# EAGLE design mainboard (EAGLE 9.2.1)
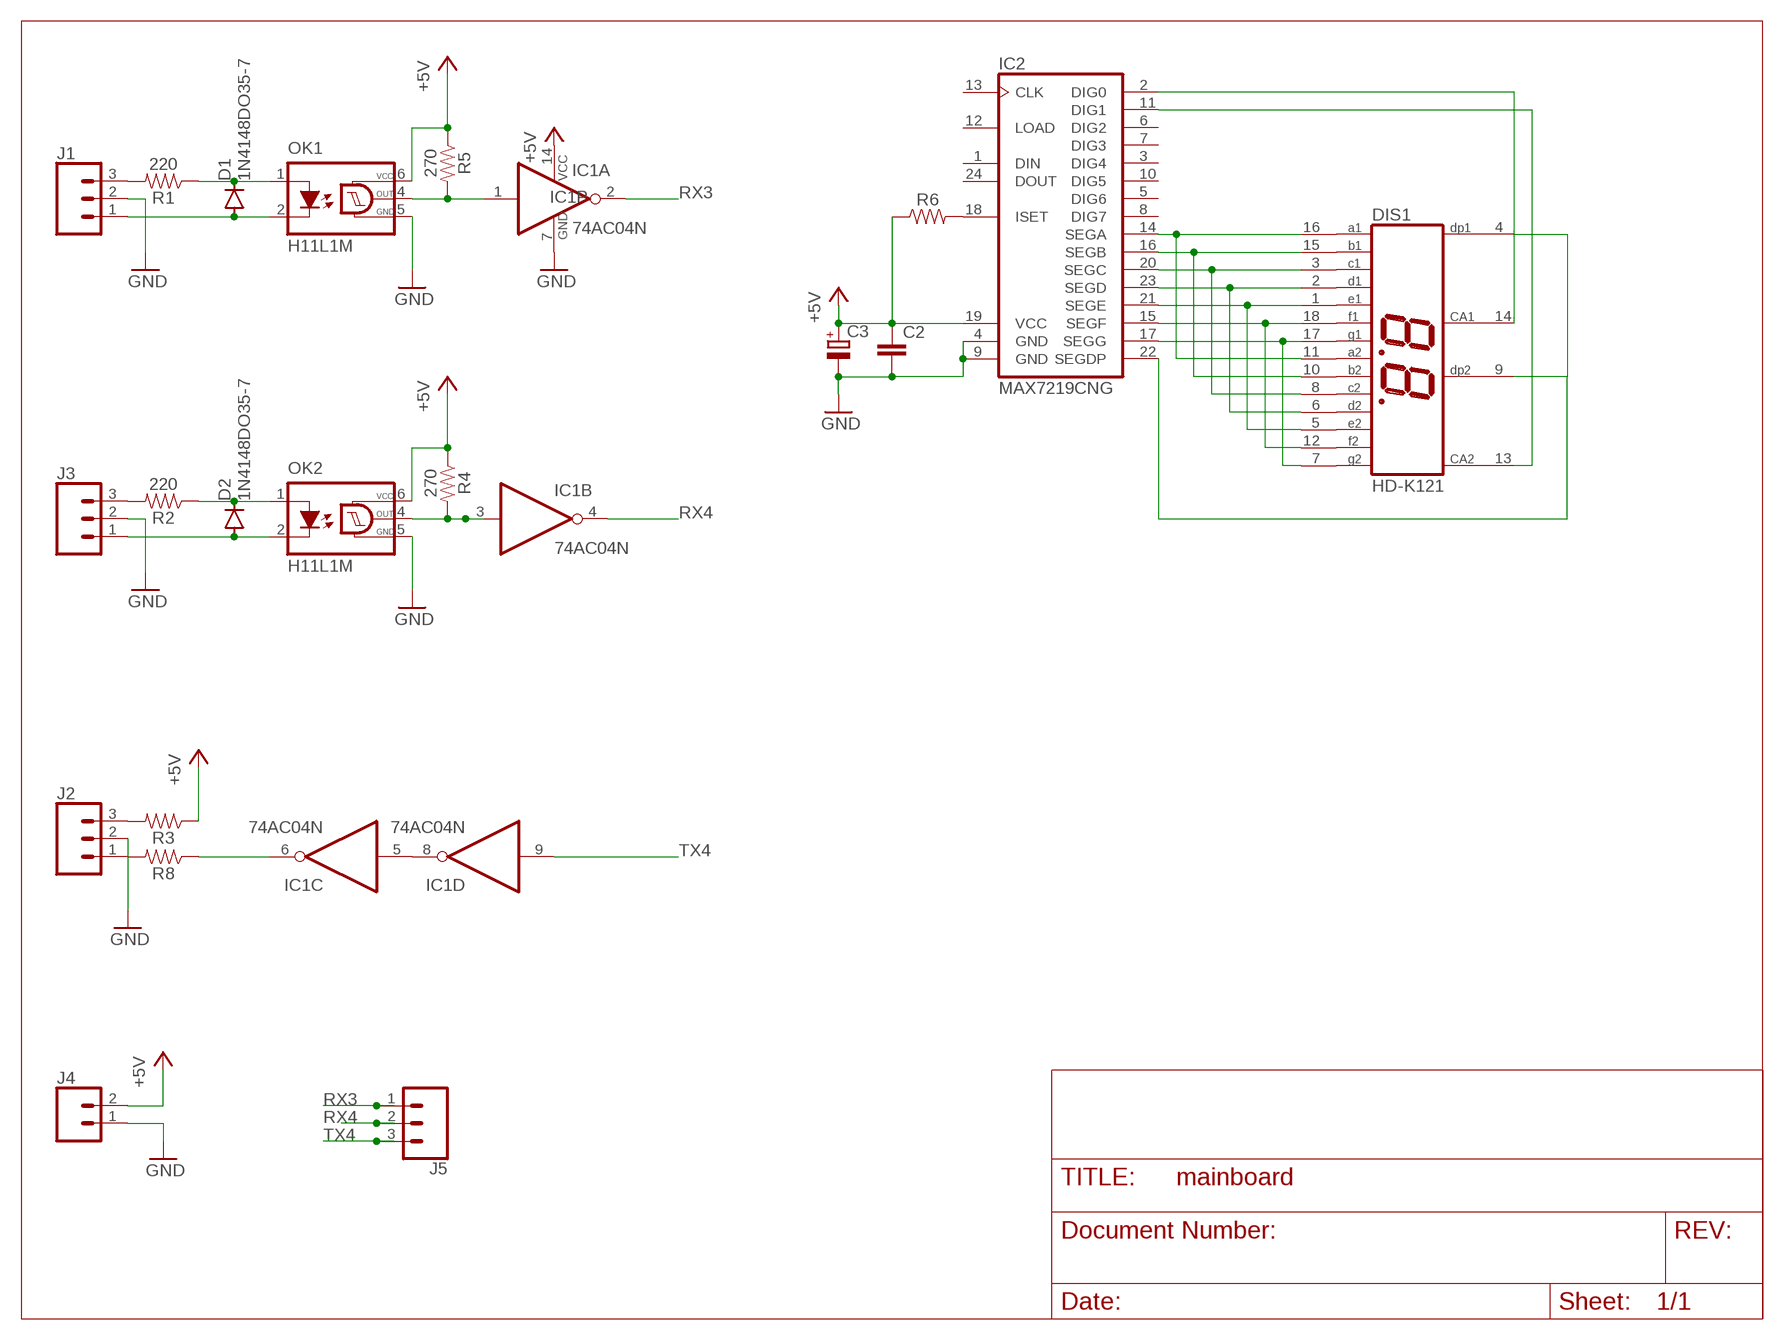
[diagram p0: schematic, sheet 1]

## Parts
C2  C-EU025-025X050  [C025-025X050]
C3  CPOL-EUE1.8-4  [E1,8-4]
D1  1N4148DO35-7  [DO35-7]
D2  1N4148DO35-7  [DO35-7]
DIS1  HD-K121  [HDSP-R]
IC1  74AC04N  [DIL14]
IC2  MAX7219CNG  [DIL24-3]
J1  CONN_03  [1X03]
J2  CONN_03  [1X03]
J3  CONN_03  [1X03]
J4  CONN_02  [1X02]
J5  CONN_03  [1X03]
OK1  H11L1M  [DIL06]
OK2  H11L1M  [DIL06]
R1  220  RESISTORAXIAL-0.3  [AXIAL-0.3]
R2  220  RESISTORAXIAL-0.3  [AXIAL-0.3]
R3  RESISTORAXIAL-0.3  [AXIAL-0.3]
R4  270  RESISTORAXIAL-0.3  [AXIAL-0.3]
R5  270  RESISTORAXIAL-0.3  [AXIAL-0.3]
R6  RESISTORAXIAL-0.3  [AXIAL-0.3]
R8  RESISTORAXIAL-0.3  [AXIAL-0.3]

## Nets
+5V: C2.1 C3.+ IC1.14(P:VCC) IC2.19(VCC) J4.2 OK1.6(VCC) OK2.6(VCC) R3.P$1 R4.P$1 R5.P$1 R6.P$1
GND: C2.2 C3.- IC1.7(P:GND) IC2.4(GND) IC2.9(GND) J1.2 J2.2 J3.2 J4.1 OK1.5(GND) OK2.5(GND)
N$1: IC1.5(C:I) IC1.8(D:O)
N$2: J1.3 R1.P$2
N$3: D1.A J1.1 OK1.2(C)
N$4: D1.C OK1.1(A) R1.P$1
N$5: J3.3 R2.P$2
N$6: D2.A J3.1 OK2.2(C)
N$7: D2.C OK2.1(A) R2.P$1
N$8: IC1.1(A:I) OK1.4(OUT) R5.P$2
N$9: IC1.3(B:I) OK2.4(OUT) R4.P$2
N$10: J2.3 R3.P$2
N$11: J2.1 R8.P$2
N$12: IC1.6(C:O) R8.P$1
N$13: IC2.18(ISET) R6.P$2
N$14: DIS1.11(A2) DIS1.16(A1) IC2.14(SEGA)
N$15: DIS1.10(B2) DIS1.15(B1) IC2.16(SEGB)
N$16: DIS1.3(C1) DIS1.8(C2) IC2.20(SEGC)
N$17: DIS1.2(D1) DIS1.6(D2) IC2.23(SEGD)
N$18: DIS1.1(E1) DIS1.5(E2) IC2.21(SEGE)
N$19: DIS1.12(F2) DIS1.18(F1) IC2.15(SEGF)
N$20: DIS1.7(G2) DIS1.17(G1) IC2.17(SEGG)
N$23: DIS1.4(DP1) DIS1.9(DP2) IC2.22(SEGDP)
N$25: DIS1.14(CA1) IC2.2(DIG0)
N$26: DIS1.13(CA2) IC2.11(DIG1)
RX3: IC1.2(A:O) J5.1
RX4: IC1.4(B:O) J5.2
TX4: IC1.9(D:I) J5.3
Unconnected: IC1.10(E:O) IC1.11(E:I) IC1.12(F:O) IC1.13(F:I) IC2.1(DIN) IC2.3(DIG4) IC2.5(DIG6) IC2.6(DIG2) IC2.7(DIG3) IC2.8(DIG7) IC2.10(DIG5) IC2.12(LOAD) IC2.13(CLK) IC2.24(DOUT)

## Library data of the parts
C2 = rcl:C-EU: CAPACITOR, European symbol; SPICEPREFIX: C
C3 = rcl:CPOL-EU: POLARIZED CAPACITOR, European symbol; SPICEPREFIX: C
D1 D2 = diode:1N4148: DIODE high speed (Philips)
DIS1 = display-hp:HD-K121: LED DISPLAY 2 x 1 character 7 segment, decimal points right; OC_FARNELL: unknown; OC_NEWARK: unknown
IC1 = 74xx-eu:74*04: Hex INVERTER
IC2 = maxim:MAX7219CNG: LED DISPLAY DRIVER; MF: MAXIM; MPN: MAX7219CNG; OC_FARNELL: 1523914; OC_NEWARK: 34C4018
J1-J3 J5 = SparkFun-Connectors:CONN_03: Multi connection point. Often used as Generic Header-pin footprint for 0.1 inch spaced/style header connections On any of the 0.1 inch spaced packages, you can populate with these: Break Away Headers - Straight <https://www.sparkfun.com/products/116> (PRT-00116) Break Away Male Headers - Right Angle <https://www.sparkfun.com/products/553> (PRT-00553) Female Headers <https://www.sparkfun.com/products/115> (PRT-00115) Break Away Headers - Machine Pin <https://www.sparkfun.com/products/117> (PRT-00117) Break Away Female Headers - Swiss Machine Pin <https://www.sparkfun.com/products/743> (PRT-00743) Stackable Header - 3 Pin (Female, 0.1") <https://www.sparkfun.com/products/13875> (PRT-13875) For SCREWTERMINALS and SPRING TERMINALS visit here: Screw Terimnals on SparkFun.com <https://www.sparkfun.com/search/results?term=Screw+Terminals> (5mm/3.5mm/2.54mm spacing) This device is also useful as a general connection point to wire up your design to another part of your project. Our various solder wires solder well into these plated through hole pads. Hook-Up Wire - Assortment (Stranded, 22 AWG) <https://www.sparkfun.com/products/11375> (PRT-11375) Hook-Up Wire - Assortment (Solid Core, 22 AWG) <https://www.sparkfun.com/products/11367> (PRT-11367) View the entire wire category on our website here <https://www.sparkfun.com/categories/141> Special notes: Molex polarized connector foot print use with SKU : PRT-08232 with associated crimp pins and housings.
J4 = SparkFun-Connectors:CONN_02: Multi connection point. Often used as Generic Header-pin footprint for 0.1 inch spaced/style header connections On any of the 0.1 inch spaced packages, you can populate with these: Break Away Headers - Straight <https://www.sparkfun.com/products/116> (PRT-00116) Break Away Male Headers - Right Angle <https://www.sparkfun.com/products/553> (PRT-00553) Female Headers <https://www.sparkfun.com/products/115> (PRT-00115) Break Away Headers - Machine Pin <https://www.sparkfun.com/products/117> (PRT-00117) Break Away Female Headers - Swiss Machine Pin <https://www.sparkfun.com/products/743> (PRT-00743) For SCREWTERMINALS and SPRING TERMINALS visit here: Screw Terimnals on SparkFun.com <https://www.sparkfun.com/search/results?term=Screw+Terminals> (5mm/3.5mm/2.54mm spacing) This device is also useful as a general connection point to wire up your design to another part of your project. Our various solder wires solder well into these plated through hole pads. Hook-Up Wire - Assortment (Stranded, 22 AWG) <https://www.sparkfun.com/products/11375> (PRT-11375) Hook-Up Wire - Assortment (Solid Core, 22 AWG) <https://www.sparkfun.com/products/11367> (PRT-11367) View the entire wire category on our website here <https://www.sparkfun.com/categories/141> Special notes: Molex polarized connector foot print use with: PRT-08233 with associated crimp pins and housings. 2.54_SCREWTERM for use with PRT-10571. 3.5mm Screw Terminal footprints for PRT-08084 5mm Screw Terminal footprints for use with PRT-08432
OK1 OK2 = optocoupler:H11L*M: 6-Pin DIP Optocoupler Source: http://www.fairchildsemi.com/ds/H1/H11L2-M.pdf; MF: FAIRCHILD SEMICONDUCTOR; MPN: H11L1-M; OC_FARNELL: 1021127; OC_NEWARK: 72K8643
R1-R6 R8 = SparkFun-Resistors:RESISTOR: Generic Resistor Package

## Board
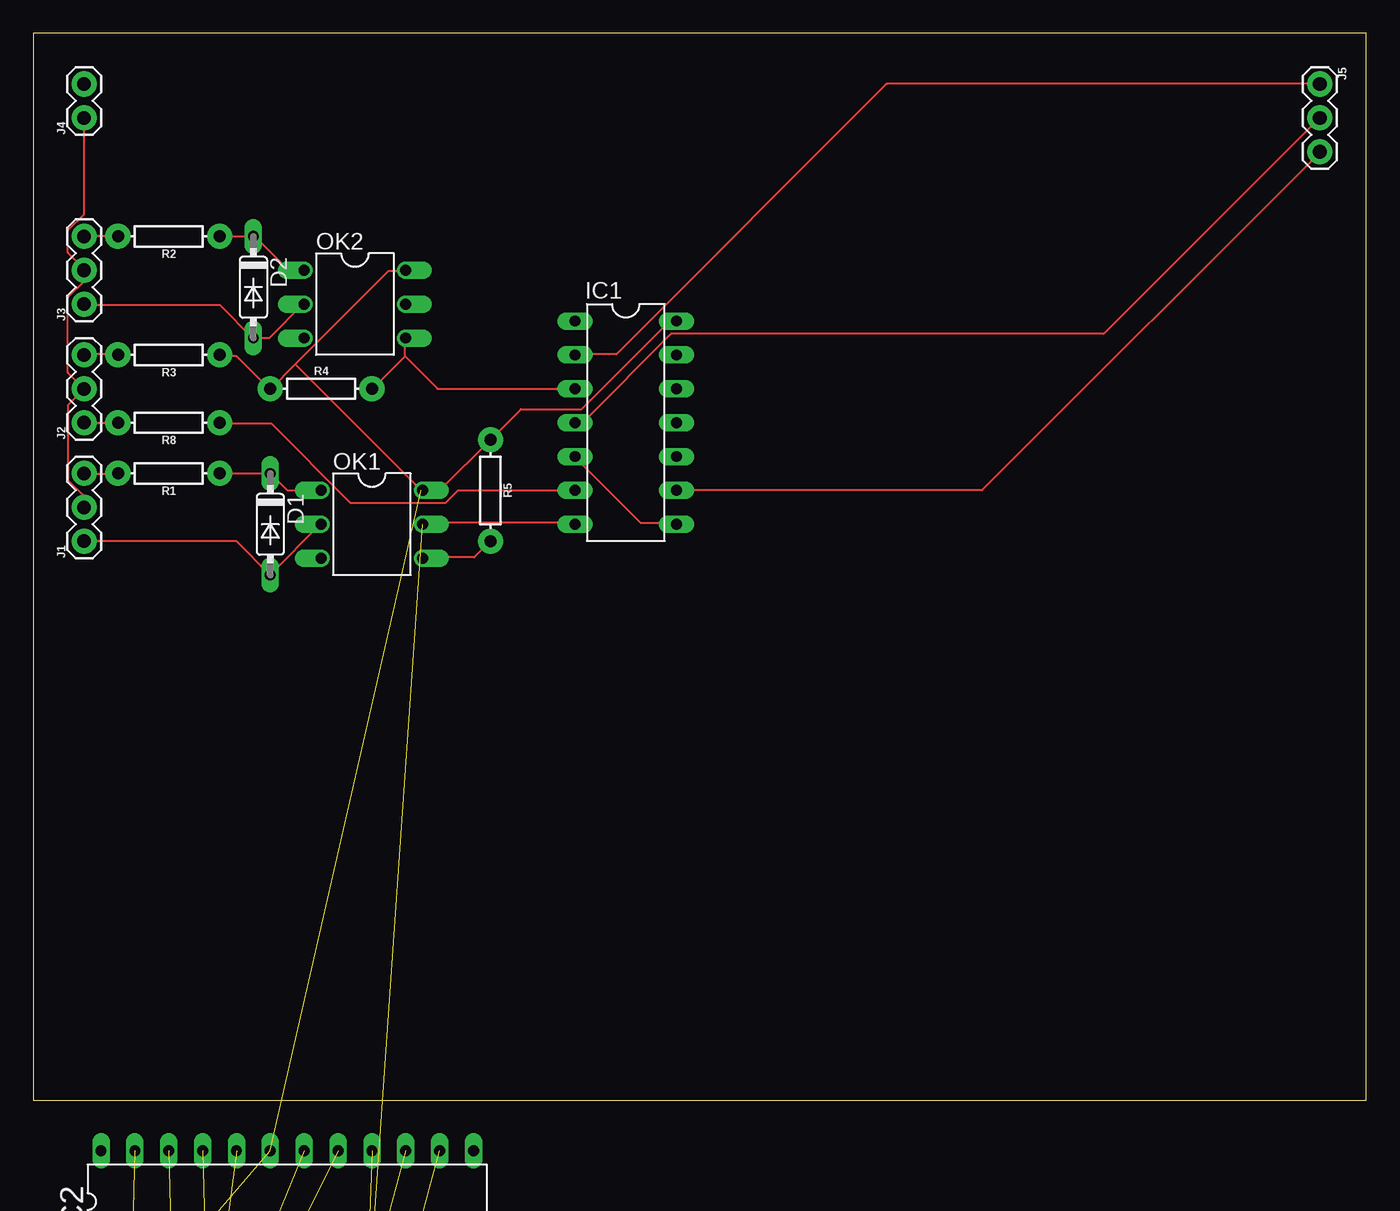
[diagram p1: board, top side]
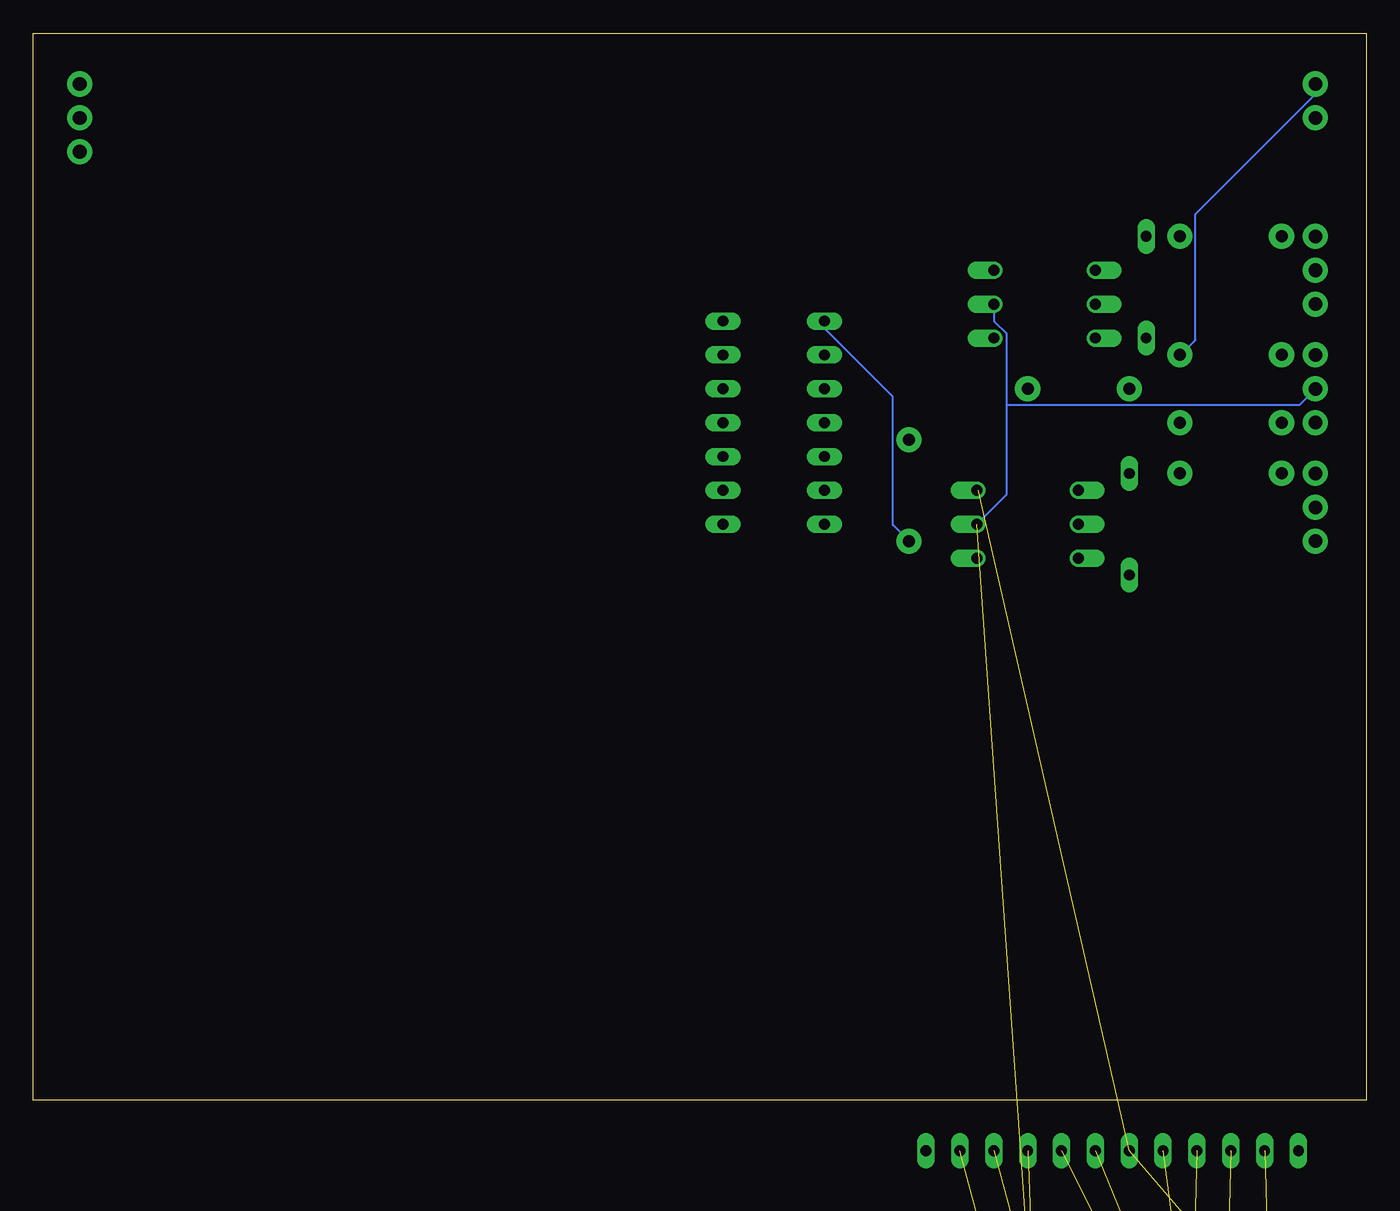
[diagram p2: board, bottom side, seen from below]

Size 100 x 80 mm. Coordinates in mm from the lower left corner, seen from the top.
Outline: 0,0 100,0 100,80 0,80 0,0
Copper layers (1*16): Top 0.035mm / dielectric 1.5mm / Bottom 0.035mm
Design rules "default": minimum track width 6mil, minimum drill 0.35mm, track to track 6mil, track to pad 6mil, pad to pad 6mil, via to via 6mil, smd to smd 6mil, copper to edge 40mil, drill to drill 6mil, minimum pad ring 10mil, minimum via ring 8mil, stop-mask expansion 4mil, vias tented up to drill 0mil, thermal gap 10mil

### Footprints (pad centres in the part's own frame; a part is rotated, then mirrored left to right if it is on the bottom)
C025-025X050 = drill 0.813 octagon: 1 -1.27,0; 2 1.27,0
E1,8-4 = drill 0.711 pad 1.168: + -0.889,0 | drill 0.711 pad 1.168 octagon: - 0.889,0
DO35-7 = drill 0.813 long: A 3.81,0; C -3.81,0
HDSP-R = drill 0.813 long: 1 -10.16,-7.62; 2 -7.62,-7.62; 3 -5.08,-7.62; 4 -2.54,-7.62; 5 0,-7.62; 6 2.54,-7.62; 7 5.08,-7.62; 8 7.62,-7.62; 9 10.16,-7.62; 10 10.16,7.62; 11 7.62,7.62; 12 5.08,7.62; 13 2.54,7.62; 14 0,7.62; 15 -2.54,7.62; 16 -5.08,7.62; 17 -7.62,7.62; 18 -10.16,7.62
DIL14 = drill 0.813 long: 1 -7.62,-3.81; 2 -5.08,-3.81; 3 -2.54,-3.81; 4 0,-3.81; 5 2.54,-3.81; 6 5.08,-3.81; 7 7.62,-3.81; 8 7.62,3.81; 9 5.08,3.81; 10 2.54,3.81; 11 0,3.81; 12 -2.54,3.81; 13 -5.08,3.81; 14 -7.62,3.81
DIL24-3 = drill 0.813 long: 1 -13.97,-3.81; 2 -11.43,-3.81; 3 -8.89,-3.81; 4 -6.35,-3.81; 5 -3.81,-3.81; 6 -1.27,-3.81; 7 1.27,-3.81; 8 3.81,-3.81; 9 6.35,-3.81; 10 8.89,-3.81; 11 11.43,-3.81; 12 13.97,-3.81; 13 13.97,3.81; 14 11.43,3.81; 15 8.89,3.81; 16 6.35,3.81; 17 3.81,3.81; 18 1.27,3.81; 19 -1.27,3.81; 20 -3.81,3.81; 21 -6.35,3.81; 22 -8.89,3.81; 23 -11.43,3.81; 24 -13.97,3.81
1X03 = drill 1.016 pad 1.88: 1 0,0; 2 2.54,0; 3 5.08,0
1X02 = drill 1.016 pad 1.88: 1 0,0; 2 2.54,0
DIL06 = drill 0.813 offset: 1 -2.54,-3.81; 2 0,-3.81; 3 2.54,-3.81; 4 2.54,3.81; 5 0,3.81; 6 -2.54,3.81
AXIAL-0.3 = drill 0.9 pad 1.88: P$1 -3.81,0; P$2 3.81,0

### Placement (x,y rotation side)
C2  3.81,-21.59 0 top  (outside the outline)
C3  2.54,-26.67 0 top  (outside the outline)
D1  17.78,43.18 270 top
D2  16.51,60.96 270 top
DIS1  13.97,-44.45 0 top  (outside the outline)
IC1  44.45,50.8 270 top
IC2  19.05,-7.62 0 top  (outside the outline)
J1  3.81,41.91 90 top
J2  3.81,50.8 90 top
J3  3.81,59.69 90 top
J4  3.81,73.66 90 top
J5  96.52,76.2 270 top
OK1  25.4,43.18 270 top
OK2  24.13,59.69 270 top
R1  10.16,46.99 180 top
R2  10.16,64.77 180 top
R3  10.16,55.88 180 top
R4  21.59,53.34 0 top
R5  34.29,45.72 270 top
R6  5.08,-31.75 0 top  (outside the outline)
R8  10.16,50.8 180 top

### Tracks (layer width: path | path; a pad name or v marks a point on that pad's centre or on a via)
+5V  (4 unrouted)
  Top 0.152: IC1.14 48.16,58.37 47.7,58.37 41.15,51.82 36.58,51.82 R5.P$1 30.48,45.72 OK1.6 29.11,45.72 19.66,55.17 | 19.66,55.17 17.83,53.34 R4.P$1 17.68,53.34 15.24,55.78 14.02,55.78 R3.P$1 | 19.66,55.17 26.67,62.18 27.89,62.18 OK2.6
  Bottom 0.152: J4.2 3.81,75.44 12.8,66.45 12.8,57 13.87,55.93 R3.P$1
GND  (4 unrouted)
  Top 0.152: OK1.5 29.26,43.28 40.54,43.28 IC1.7 | J1.2 3.81,45.26 2.59,46.48 2.59,52.12 J2.2 2.59,54.56 2.59,60.2 3.81,61.42 J3.2 3.81,62.33 2.59,63.55 2.59,65.23 3.81,66.45 J4.1
  Bottom 0.152: 26.98,52.12 26.98,45.41 OK1.5 | 26.98,52.12 26.98,57.45 27.89,58.37 27.89,59.59 OK2.5 | 26.98,52.12 5.03,52.12 J2.2
N$1
  Top 0.152: IC1.8 48.16,43.28 45.57,43.28 40.69,48.16 IC1.5
N$2
  Top 0.152: J1.3 3.81,46.94 6.25,46.94 R1.P$2
N$3
  Top 0.152: OK1.2 21.49,43.13 17.83,39.47 D1.A 15.24,41.91 J1.1
N$4
  Top 0.152: R1.P$1 D1.C 19.05,45.72 OK1.1
N$5
  Top 0.152: R2.P$2 J3.3
N$6
  Top 0.152: OK2.2 20.27,59.74 17.68,57.15 D2.A 16.46,57.15 14.02,59.59 3.81,59.59 J3.1
N$7
  Top 0.152: R2.P$1 D2.C 16.61,64.77 19.05,62.33 20.27,62.33 OK2.1
N$8
  Top 0.152: R5.P$2 33.07,40.69 29.26,40.69 OK1.4
  Bottom 0.152: R5.P$2 35.51,43.13 35.51,52.73 40.54,57.76 40.54,58.37 IC1.1
N$9
  Top 0.152: 27.89,55.78 27.89,57.15 OK2.4 | 27.89,55.78 25.45,53.34 R4.P$2 | IC1.3 30.33,53.34 27.89,55.78
N$10
  Top 0.152: J2.3 3.81,55.93 6.25,55.93 R3.P$2
N$11
  Top 0.152: J2.1 3.81,50.75 6.25,50.75 R8.P$2
N$12
  Top 0.152: IC1.6 31.85,45.72 30.94,44.81 23.77,44.81 17.83,50.75 14.02,50.75 R8.P$1
N$13  (1 unrouted)
N$14  (2 unrouted)
N$15  (2 unrouted)
N$16  (2 unrouted)
N$17  (2 unrouted)
N$18  (2 unrouted)
N$19  (2 unrouted)
N$20  (2 unrouted)
N$23  (2 unrouted)
N$25  (1 unrouted)
N$26  (1 unrouted)
RX3
  Top 0.152: J5.1 64.01,76.2 43.74,55.93 40.69,55.93 IC1.2
RX4
  Top 0.152: J5.2 80.31,57.45 47.85,57.45 41.3,50.9 40.69,50.9 IC1.4
TX4
  Top 0.152: IC1.9 71.17,45.72 96.47,71.02 J5.3